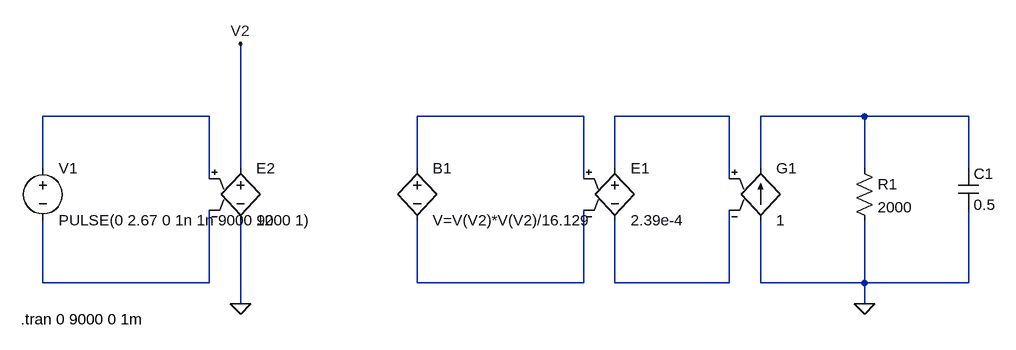
[diagram p0: schematic Equivalente_Elétrico_da_Planta_Grupo2EL.asc]
Equivalente_Elétrico_da_Planta_Grupo2EL.asc, the LTspice schematic file:
Version 4
SHEET 1 880 680
WIRE -848 48 -1104 48
WIRE -272 48 -528 48
WIRE -48 48 -224 48
WIRE 160 48 0 48
WIRE 320 48 160 48
WIRE -1104 128 -1104 48
WIRE -800 128 -800 -64
WIRE -528 128 -528 48
WIRE -224 128 -224 48
WIRE 0 128 0 48
WIRE 160 128 160 48
WIRE 320 128 320 48
WIRE -848 144 -848 48
WIRE -272 144 -272 48
WIRE -48 144 -48 48
WIRE -1104 304 -1104 208
WIRE -848 304 -848 192
WIRE -848 304 -1104 304
WIRE -528 304 -528 208
WIRE -272 304 -272 192
WIRE -272 304 -528 304
WIRE -224 304 -224 208
WIRE -48 304 -48 192
WIRE -48 304 -224 304
WIRE 0 304 0 208
WIRE 160 304 160 208
WIRE 160 304 0 304
WIRE 320 304 320 192
WIRE 320 304 160 304
WIRE -800 336 -800 208
WIRE 160 336 160 304
FLAG -800 336 0
FLAG 160 336 0
FLAG -800 -64 V2
SYMBOL cap 304 128 R0
SYMATTR InstName C1
SYMATTR Value 0.5
SYMBOL res 144 112 R0
SYMATTR InstName R1
SYMATTR Value 2000
SYMBOL g 0 112 R0
SYMATTR InstName G1
SYMATTR Value 1
SYMBOL e -224 112 R0
SYMATTR InstName E1
SYMATTR Value 2.39e-4
SYMBOL bv -528 112 R0
SYMATTR InstName B1
SYMATTR Value V=V(V2)*V(V2)/16.129
SYMBOL e -800 112 R0
SYMATTR InstName E2
SYMATTR Value 12
SYMBOL voltage -1104 112 R0
WINDOW 123 0 0 Left 0
WINDOW 39 0 0 Left 0
SYMATTR InstName V1
SYMATTR Value PULSE(0 2.67 0 1n 1n 9000 9000 1)
TEXT -1138 360 Left 2 !.tran 0 9000 0 1m

The netlist it stands for:
* Equivalente_Elétrico_da_Planta_Grupo2EL.asc
C1 N004 0 0.5
R1 N004 0 2000
G1 0 N004 N003 N007 1
E1 N003 N007 N002 N006 2.39e-4
B1 N002 N006 V=V(V2)*V(V2)/16.129
E2 V2 0 N001 N005 12
V1 N001 N005 PULSE(0 2.67 0 1n 1n 9000 9000 1)
.tran 0 9000 0 1m
.backanno
.end